# EAGLE design amp_test_arm_qfp (EAGLE 7.6.0)
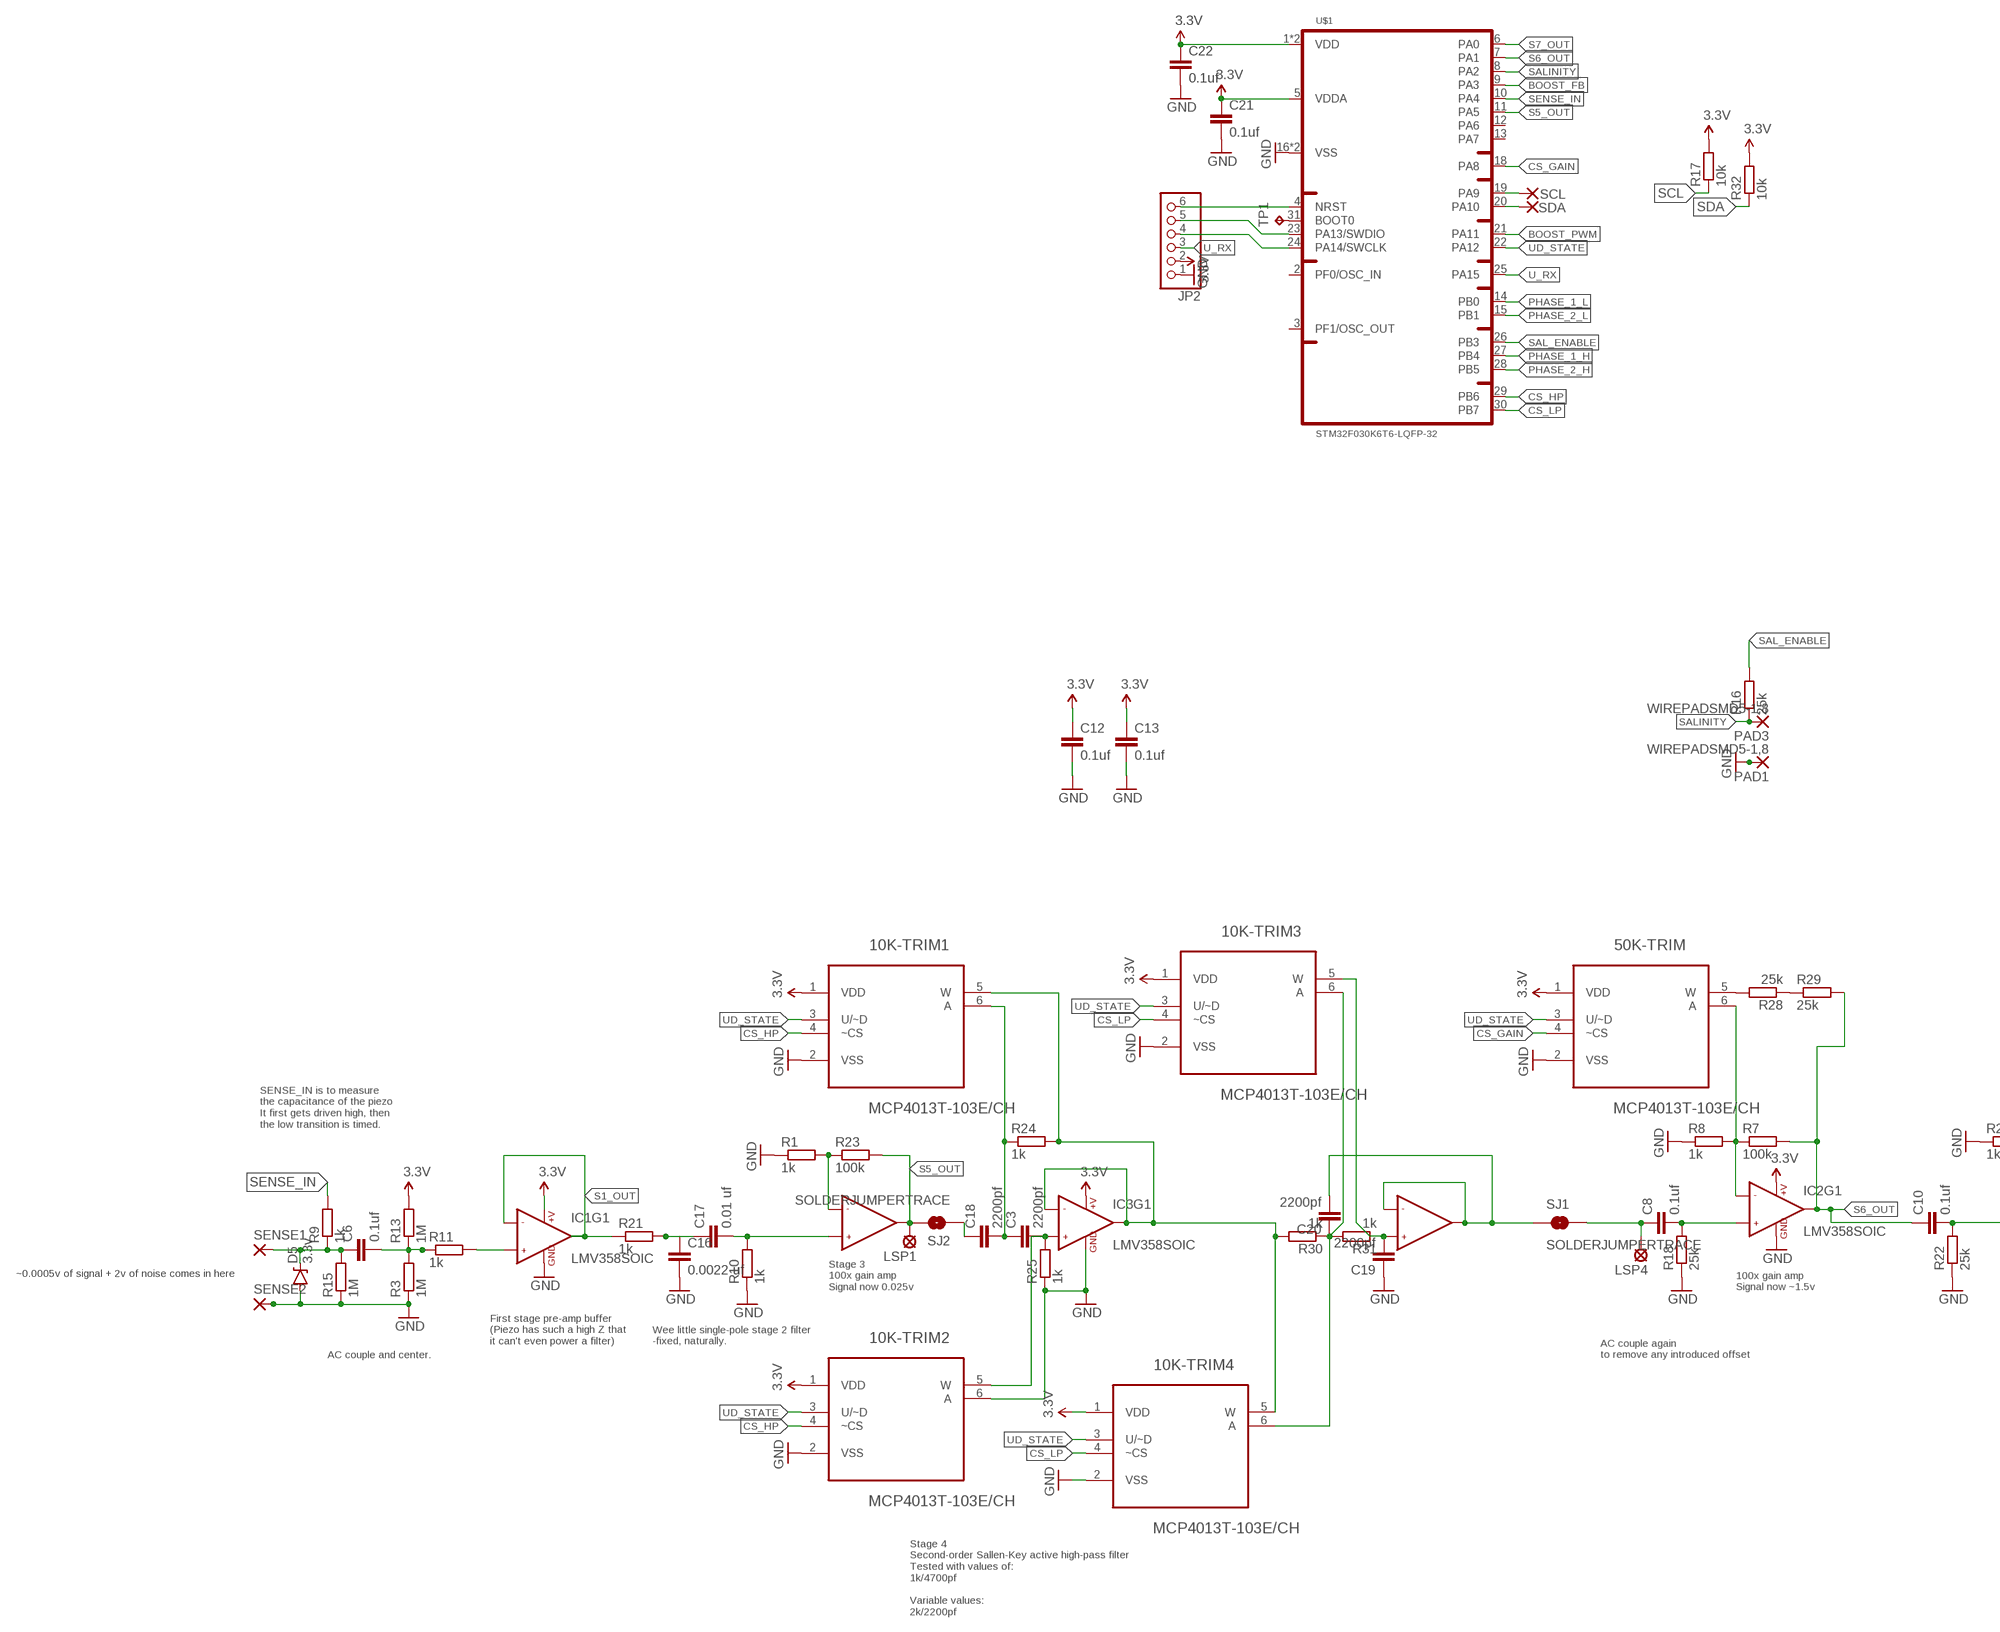
[diagram p0: schematic, sheet 1, part 1 of 2]
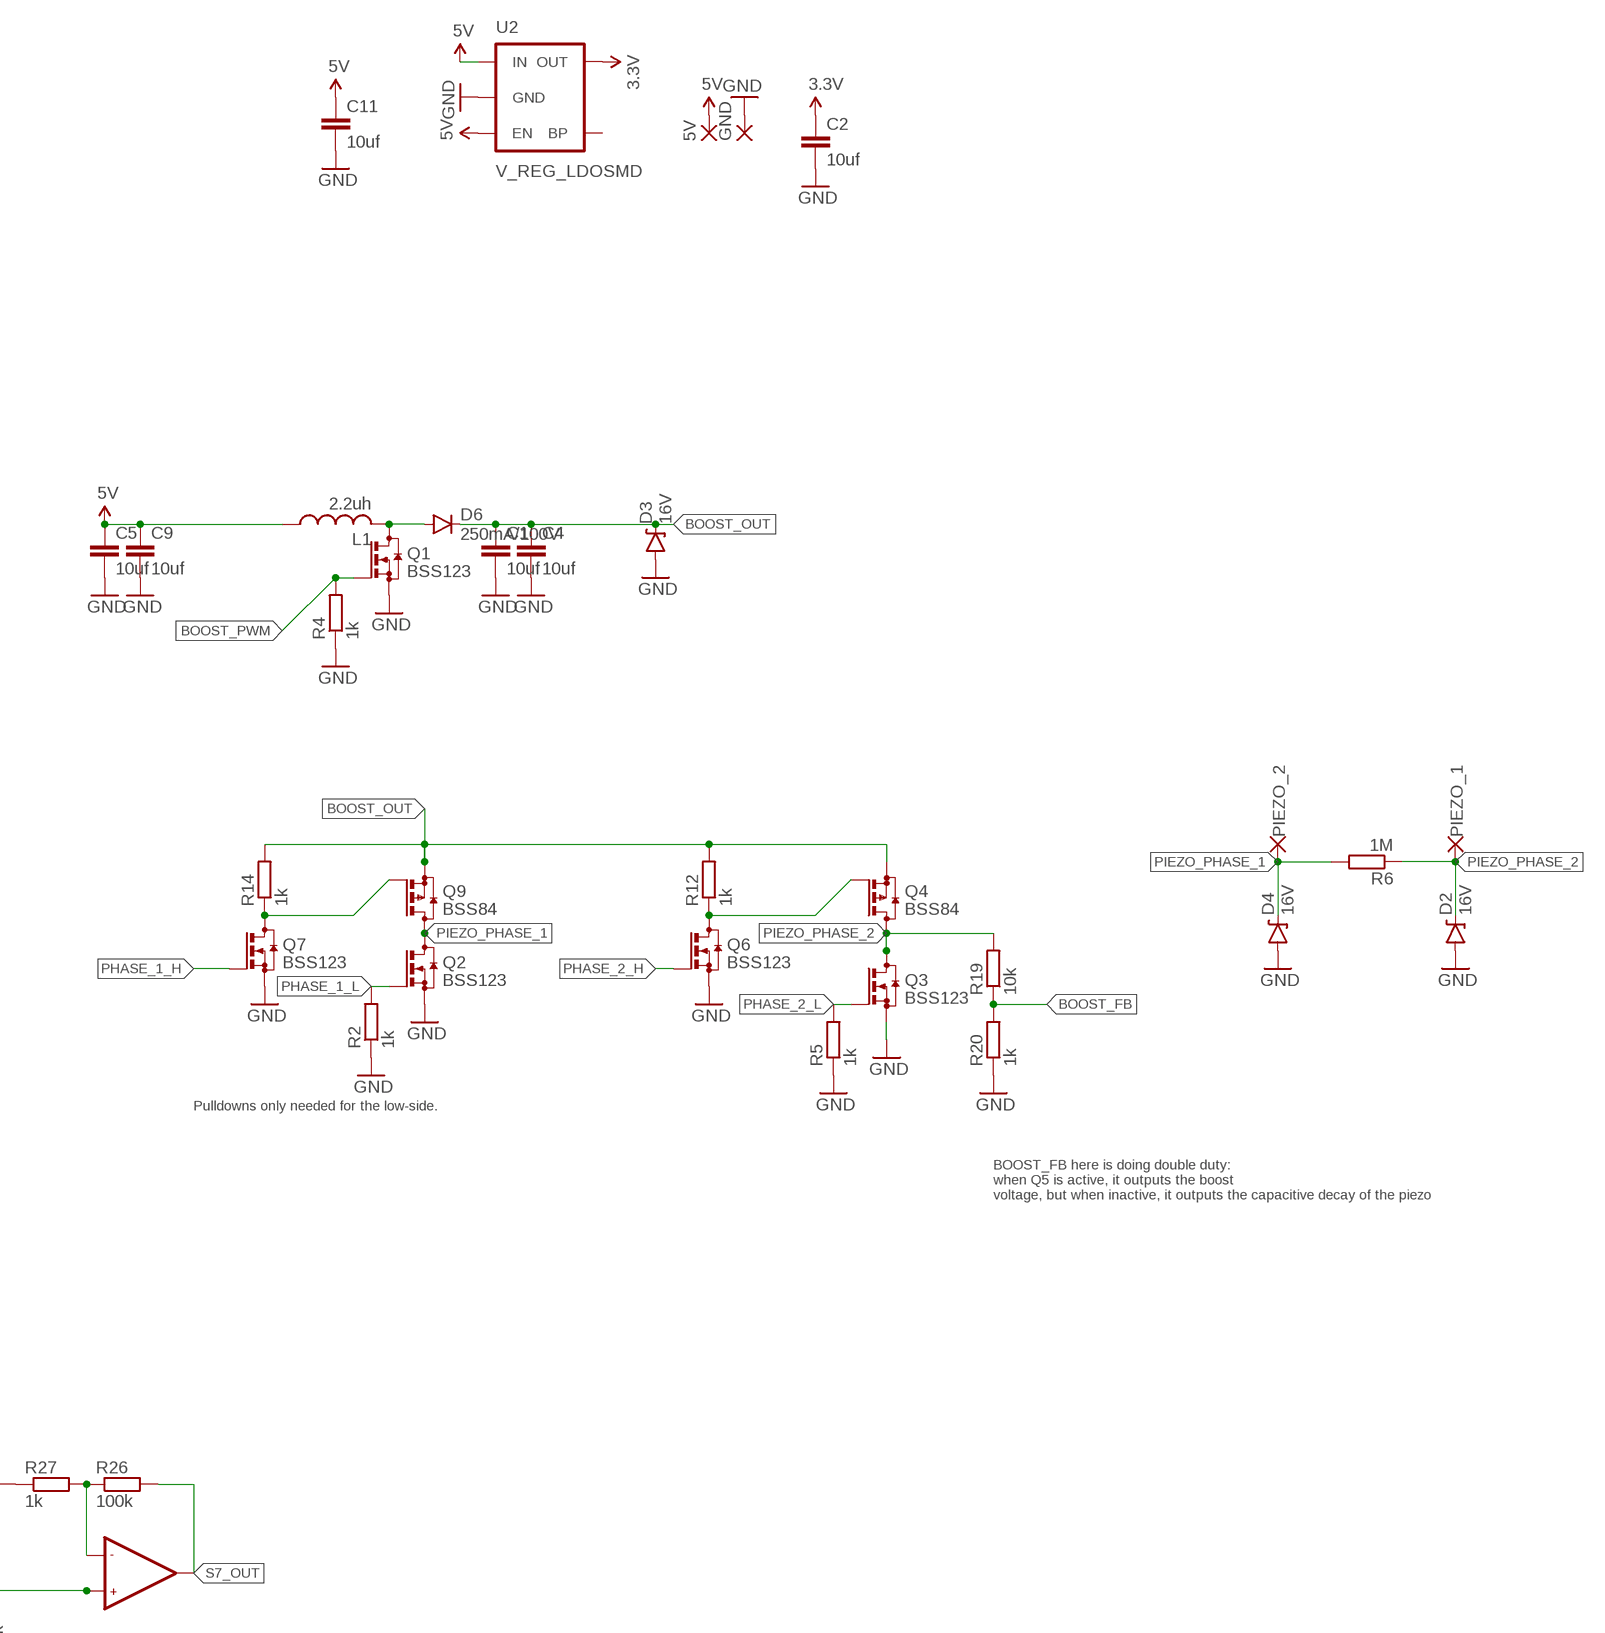
[diagram p1: schematic, sheet 1, part 2 of 2]

## Parts
5V  SMD5  [SMD2,54-5,08]
10K-TRIM1  MCP4013T-103E/CH  [SOT95P280X145-6N]
10K-TRIM2  MCP4013T-103E/CH  [SOT95P280X145-6N]
10K-TRIM3  MCP4013T-103E/CH  [SOT95P280X145-6N]
10K-TRIM4  MCP4013T-103E/CH  [SOT95P280X145-6N]
50K-TRIM  MCP4013T-103E/CH  [SOT95P280X145-6N]
C1  10uf  C-EUC0805  [C0805]
C2  10uf  C-EUC0603  [C0603]
C3  2200pf  C-EUC0603  [C0603]
C4  10uf  C-EUC0805  [C0805]
C5  10uf  C-EUC0603  [C0603]
C6  0.1uf  C-EUC0603  [C0603]
C8  0.1uf  C-EUC0603  [C0603]
C9  10uf  C-EUC0603  [C0603]
C10  0.1uf  C-EUC0603  [C0603]
C11  10uf  C-EUC0603  [C0603]
C12  0.1uf  C-EUC0603  [C0603]
C13  0.1uf  C-EUC0603  [C0603]
C16  0.0022 uf  C-EUC0603  [C0603]
C17  0.01 uf  C-EUC0603  [C0603]
C18  2200pf  C-EUC0603  [C0603]
C19  2200pf  C-EUC0603  [C0603]
C20  2200pf  C-EUC0603  [C0603]
C21  0.1uf  C-EUC0603  [C0603]
C22  0.1uf  C-EUC0603  [C0603]
D2  16V  DIODE-ZENER3.3V  [SOD-323]
D3  16V  DIODE-ZENER3.3V  [SOD-323]
D4  16V  DIODE-ZENER3.3V  [SOD-323]
D5  3.3v  DIODE-ZENER3.3V  [SOD-323]
D6  250mA/100V  DIODEBAS16  [SOD-323]
GND  SMD5  [SMD2,54-5,08]
IC1  LMV358SOIC  [SO08]
IC2  LMV358SOIC  [SO08]
IC3  LMV358SOIC  [SO08]
JP2  PINHD-1X6  [1X06]
L1  2.2uh  L-USL2825P  [L2825P]
LSP1  LSP10  [LSP10]
LSP4  LSP10  [LSP10]
PAD1  WIREPADSMD5-1,8  [5-1,8]
PAD3  WIREPADSMD5-1,8  [5-1,8]
PIEZO_1  SMD5  [SMD2,54-5,08]
PIEZO_2  SMD5  [SMD2,54-5,08]
Q1  BSS123  [SOT23]
Q2  BSS123  [SOT23]
Q3  BSS123  [SOT23]
Q4  BSS84  [SOT23]
Q6  BSS123  [SOT23]
Q7  BSS123  [SOT23]
Q9  BSS84  [SOT23]
R1  1k  R-EU_R0603  [R0603]
R2  1k  R-EU_R0603  [R0603]
R3  1M  R-EU_R0603  [R0603]
R4  1k  R-EU_R0603  [R0603]
R5  1k  R-EU_R0603  [R0603]
R6  1M  R-EU_R0603  [R0603]
R7  100k  R-EU_R0603  [R0603]
R8  1k  R-EU_R0603  [R0603]
R9  1k  R-EU_R0603  [R0603]
R10  1k  R-EU_R0603  [R0603]
R11  1k  R-EU_R0603  [R0603]
R12  1k  R-EU_R0603  [R0603]
R13  1M  R-EU_R0603  [R0603]
R14  1k  R-EU_R0603  [R0603]
R15  1M  R-EU_R0603  [R0603]
R16  25k  R-EU_R0603  [R0603]
R17  10k  R-EU_R0603  [R0603]
R18  25k  R-EU_R0603  [R0603]
R19  10k  R-EU_R0603  [R0603]
R20  1k  R-EU_R0603  [R0603]
R21  1k  R-EU_R0603  [R0603]
R22  25k  R-EU_R0603  [R0603]
R23  100k  R-EU_R0603  [R0603]
R24  1k  R-EU_R0603  [R0603]
R25  1k  R-EU_R0603  [R0603]
R26  100k  R-EU_R0603  [R0603]
R27  1k  R-EU_R0603  [R0603]
R28  25k  R-EU_R0603  [R0603]
R29  25k  R-EU_R0603  [R0603]
R30  1k  R-EU_R0603  [R0603]
R31  1k  R-EU_R0603  [R0603]
R32  10k  R-EU_R0603  [R0603]
SCL  SMD5  [SMD2,54-5,08]
SDA  SMD5  [SMD2,54-5,08]
SENSE1  SMD5  [SMD2,54-5,08]
SENSE2  SMD5  [SMD2,54-5,08]
SJ1  SOLDERJUMPERTRACE  [SJ_2S-TRACE]
SJ2  SOLDERJUMPERTRACE  [SJ_2S-TRACE]
TP1  TPTP12R  [TP12R]
U2  V_REG_LDOSMD  [SOT23-5]
U$1  STM32F030K6T6-LQFP-32  [LQFP-32]

## Nets
3.3V: 10K-TRIM1.1(VDD) 10K-TRIM2.1(VDD) 10K-TRIM3.1(VDD) 10K-TRIM4.1(VDD) 50K-TRIM.1(VDD) C2.1 C12.1 C13.1 C21.1 C22.1 IC1.8(+V) IC2.8(+V) IC3.8(+V) JP2.2 R13.2 R17.2 R32.2 U2.5(OUT) U$1.1(VDD) U$1.5(VDDA) U$1.17(VDD)
5V: 5V.1(P) C5.1 C9.1 C11.1 L1.1 U2.1(IN) U2.3(EN)
BOOST_FB: R19.1 R20.2 U$1.9(PA3)
BOOST_OUT: C1.1 C4.1 D3.C D6.C Q4.2(S) Q9.2(S) R12.2 R14.2
BOOST_PWM: Q1.1(G) R4.2 U$1.21(PA11)
CS_GAIN: 50K-TRIM.4(~CS) U$1.18(PA8)
CS_HP: 10K-TRIM1.4(~CS) 10K-TRIM2.4(~CS) U$1.29(PB6)
CS_LP: 10K-TRIM3.4(~CS) 10K-TRIM4.4(~CS) U$1.30(PB7)
GND: 10K-TRIM1.2(VSS) 10K-TRIM2.2(VSS) 10K-TRIM2.6(A) 10K-TRIM3.2(VSS) 10K-TRIM4.2(VSS) 50K-TRIM.2(VSS) C1.2 C2.2 C4.2 C5.2 C9.2 C11.2 C12.2 C13.2 C16.2 C19.1 C21.2 C22.2 D2.A D3.A D4.A D5.A GND.1(P) IC1.4(GND) IC2.4(GND) IC3.4(GND) JP2.1 PAD1.1(P) Q1.2(S) Q2.2(S) Q3.2(S) Q6.2(S) Q7.2(S) R1.1 R2.1 R3.1 R4.1 R5.1 R8.1 R10.1 R15.1 R18.1 R20.1 R22.1 R25.1 R27.1 SENSE2.1(P) U2.2(GND) U$1.16(VSS) U$1.32(VSS)
N$1: C10.2 IC2.5(+IN2) R22.2
N$2: Q4.1(G) Q6.3(D) R12.1
N$3: C20.2 IC3.6(-IN2) IC3.7(OUT2) SJ1.1
N$4: Q7.3(D) Q9.1(G) R14.1
N$5: TP1.TP U$1.31(BOOT0)
N$6: D6.A L1.2 Q1.3(D)
N$7: C6.2 R3.2 R11.1 R13.1
N$8: IC1.3(+IN1) R11.2
N$9: C16.1 C17.1 R21.2
N$10: C8.1 LSP4.MP SJ1.2
N$11: IC1.6(-IN2) R1.2 R23.1
N$12: C18.1 SJ2.1
N$13: C17.2 IC1.5(+IN2) R10.2
N$15: 50K-TRIM.6(A) IC2.2(-IN1) R7.1 R8.2
N$18: C8.2 IC2.3(+IN1) R18.2
N$19: 10K-TRIM3.5(W) C19.2 IC3.5(+IN2) R31.1
N$21: 10K-TRIM2.5(W) C3.2 IC3.3(+IN1) R25.2
N$22: 10K-TRIM1.5(W) 10K-TRIM4.5(W) IC3.1(OUT1) IC3.2(-IN1) R24.2 R30.2
N$23: 10K-TRIM1.6(A) C3.1 C18.2 R24.1
N$25: IC2.6(-IN2) R26.1 R27.2
N$26: 50K-TRIM.5(W) R28.2
N$27: R28.1 R29.1
N$28: 10K-TRIM3.6(A) 10K-TRIM4.6(A) C20.1 R30.1 R31.2
N$29: JP2.6 U$1.4(NRST)
N$30: JP2.5 U$1.23(PA13/SWDIO)
N$31: JP2.4 U$1.24(PA14/SWCLK)
PHASE_1_H: Q7.1(G) U$1.27(PB4)
PHASE_1_L: Q2.1(G) R2.2 U$1.14(PB0)
PHASE_2_H: Q6.1(G) U$1.28(PB5)
PHASE_2_L: Q3.1(G) R5.2 U$1.15(PB1)
PIEZO_IN: C6.1 D5.C R9.1 R15.2 SENSE1.1(P)
PIEZO_PHASE_1: D4.C PIEZO_2.1(P) Q2.3(D) Q9.3(D) R6.2
PIEZO_PHASE_2: D2.C PIEZO_1.1(P) Q3.3(D) Q4.3(D) R6.1 R19.2
S1_OUT: IC1.1(OUT1) IC1.2(-IN1) R21.1
S5_OUT: IC1.7(OUT2) LSP1.MP R23.2 SJ2.2 U$1.11(PA5)
S6_OUT: C10.1 IC2.1(OUT1) R7.2 R29.2 U$1.7(PA1)
S7_OUT: IC2.7(OUT2) R26.2 U$1.6(PA0)
SAL_ENABLE: R16.2 U$1.26(PB3)
SALINITY: PAD3.1(P) R16.1 U$1.8(PA2)
SCL: R17.1 SCL.1(P) U$1.19(PA9)
SDA: R32.1 SDA.1(P) U$1.20(PA10)
SENSE_IN: R9.2 U$1.10(PA4)
U_RX: JP2.3 U$1.25(PA15)
UD_STATE: 10K-TRIM1.3(U/~D) 10K-TRIM2.3(U/~D) 10K-TRIM3.3(U/~D) 10K-TRIM4.3(U/~D) 50K-TRIM.3(U/~D) U$1.22(PA12)
Unconnected: U2.4(BP) U$1.2(PF0/OSC_IN) U$1.3(PF1/OSC_OUT) U$1.12(PA6) U$1.13(PA7)

## Notes on the sheet
- Pulldowns only needed for the low-side.
- BOOST_FB here is doing double duty:
  when Q5 is active, it outputs the boost
  voltage, but when inactive, it outputs the capacitive decay of the piezo
- SENSE_IN is to measure
  the capacitance of the piezo
  It first gets driven high, then 
  the low transition is timed.
- ~0.0005v of signal + 2v of noise comes in here
- Stage 3
  100x gain amp
  Signal now 0.025v
- 100x gain amp
  Signal now ~1.5v
- First stage pre-amp buffer
  (Piezo has such a high Z that 
  it can't even power a filter)
- Wee little single-pole stage 2 filter
  -fixed, naturally.
- AC couple and center.
- AC couple again
  to remove any introduced offset
- Stage 4
  Second-order Sallen-Key active high-pass filter
  Tested with values of:
  1k/4700pf
  
  Variable values: 
  2k/2200pf

## Library data of the parts
5V GND PIEZO_1 PIEZO_2 SCL SDA SENSE1 SENSE2 = wirepad:SMD5: SMD PAD
10K-TRIM1-10K-TRIM4 50K-TRIM = MCP4013T-103E_CH:MCP4013T-103E/CH: Digital POT; DESCRIPTION: Digital Potentiometers with SPI Interface 10k, U/D single, 6-bit V, POT to GND; DIGI-KEY_PART_NUMBER: MCP4013T-103E/CHCT-ND; DIGI-KEY_PURCHASE_URL: https://www.digikey.ca/product-detail/en/microchip-technology/MCP4013T-103E-CH/MCP4013T-103E-CHCT-ND/1015697?WT.z_cid=ref_snapeda&utm_source=snapeda&utm_medium=aggregator&utm_campaign=buynow; MF: Microchip; MP: MCP4013T-103E/CH; PACKAGE: SOT-23-6 Microchip
C1-C6 C8-C13 C16-C22 = rcl:C-EU: CAPACITOR, European symbol
D2-D5 = SparkFun-DiscreteSemi:DIODE-ZENER: Zener Diode Production Part - 8199 3.4V Zener Voltage; PROD_ID: DIO-11284; VALUE: 3.3V
D6 = SparkFun-DiscreteSemi:DIODE: Diode These are standard reverse protection diodes and small signal diodes. SMA package can handle up to about 1A. SOD-323 can handle about 200mA. What the SOD-323 package when ordering, there are some mfgs out there that are 5-pin packages.; PROD_ID: DIO-09646
IC1-IC3 = SparkFun-AnalogIC:LMV358: Jellybean rail-to-rail output op-amp; PROD_ID: IC-09657
JP2 = pinhead:PINHD-1X6: PIN HEADER
L1 = rcl:L-US: INDUCTOR, American symbol
LSP1 LSP4 = solpad:LSP10: SOLDER PAD drill 1.0 mm, distributor Buerklin, 12H555
PAD1 PAD3 = wirepad:WIREPAD: Wire PAD connect wire on PCB
Q1-Q3 Q6 Q7 = transistor-small-signal:BSS123: N-CHANNEL MOS FET
Q4 Q9 = transistor-small-signal:BSS84: P-CHANNEL MOS FET
R1-R32 = rcl:R-EU_: RESISTOR, European symbol
SJ1 SJ2 = SparkFun-Retired:SOLDERJUMPER: Solder Jumper Standard SMD solder jumper. Used to automate production. Two varients : Normally Open and Normally Closed are the same, but have different paste layers. NC will have a large amount of paste and should jumper during reflow.
TP1 = testpad:TP: Test pad
U2 = SparkFun-PowerIC:V_REG_LDO: Voltage Regulator LDO Standard 150mA LDO voltage regulator in SOT-23 layout. Micrel part MIC5205. BP (by-pass) pin is used to lower output noise with 470pF cap.
U$1 = STM32F030K6T6:STM32F030K6T6

## Net classes
0 default: width 0.254 mm, drill 0.508 mm

## Board
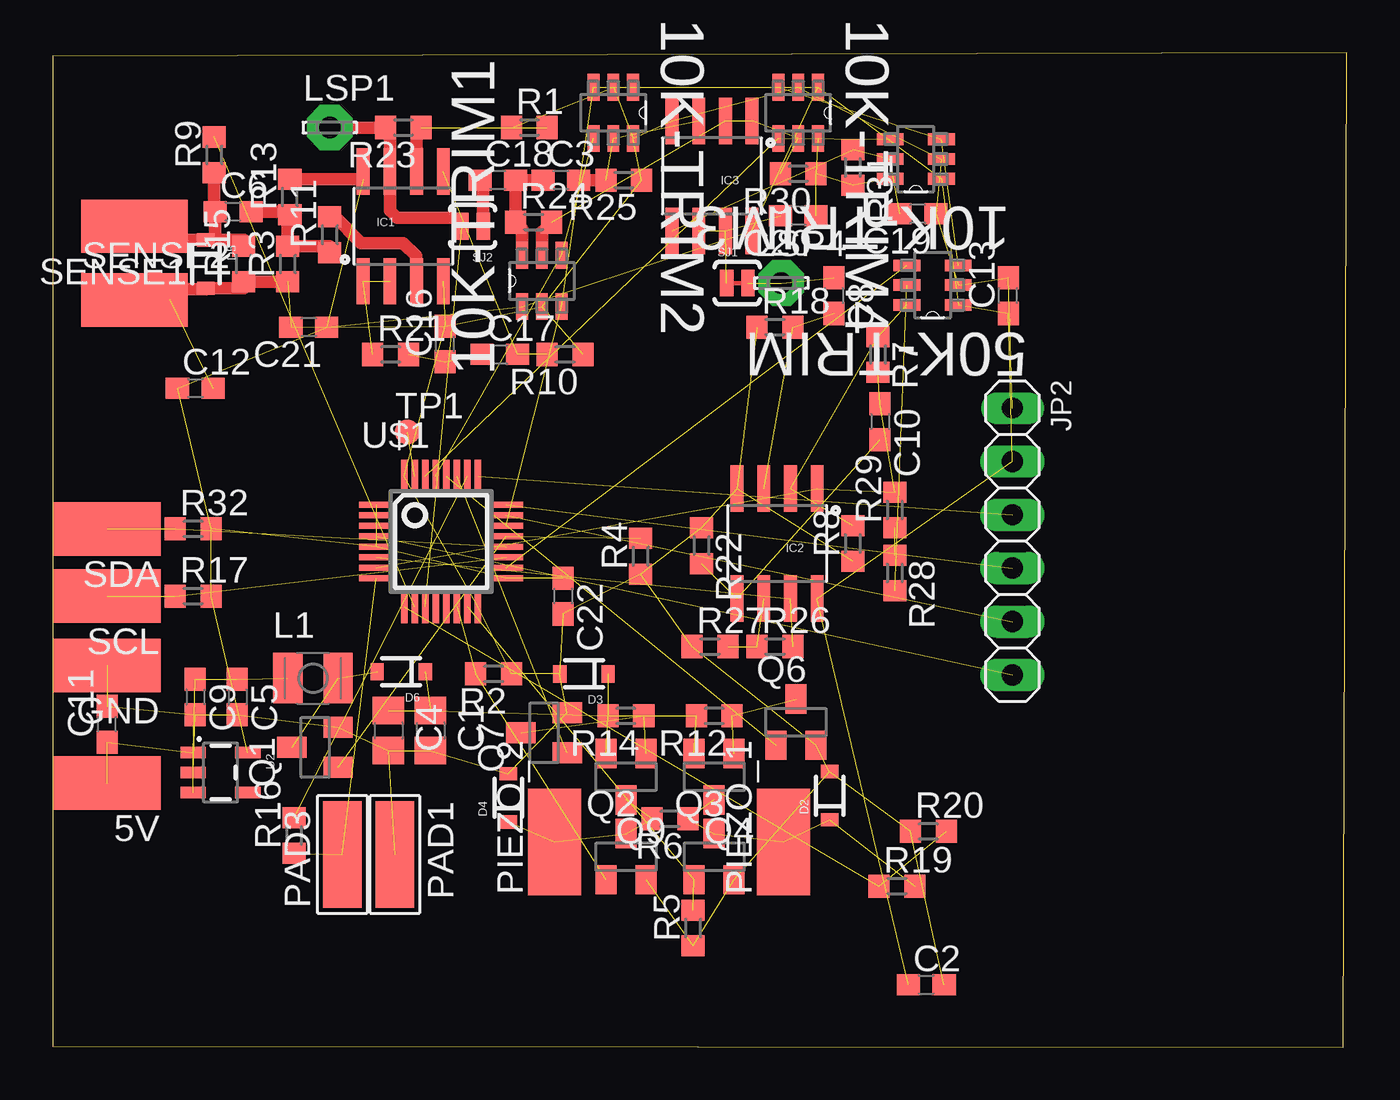
[diagram p2: board, top side]

Size 61.63 x 47.33 mm. Coordinates in mm from the lower left corner, seen from the top.
Outline: 0,0.03 61.45,0 61.63,47.33 0,47.16 0,0.03
Copper layers (1*16): Top 0.035mm / dielectric 1.5mm / Bottom 0.035mm
Design rules "default *": minimum track width 10mil, minimum drill 17mil, track to track 7mil, track to pad 7mil, pad to pad 7mil, via to via 7mil, smd to smd 7mil, copper to edge 40mil, drill to drill 8mil, minimum pad ring 10mil, minimum via ring 8mil, stop-mask expansion 4mil, vias tented up to drill 0mil, thermal gap 10mil

### Footprints (pad centres in the part's own frame; a part is rotated, then mirrored left to right if it is on the bottom)
SMD2,54-5,08 = smd 2.54 x 5.08: 1 0,0
SOT95P280X145-6N = smd 1.27 x 0.559: 1 -1.219,0.94; 2 -1.219,0; 3 -1.219,-0.94; 4 1.219,-0.94; 5 1.219,0; 6 1.219,0.94
C0805 = smd 1.3 x 1.5: 1 -0.95,0; 2 0.95,0
C0603 = smd 1.1 x 1: 1 -0.85,0; 2 0.85,0
SOD-323 = smd 0.63 x 0.83: A 1.15,0; C -1.15,0
SO08 = smd 0.61 x 2.21: 1 -1.905,-2.616; 2 -0.635,-2.616; 3 0.635,-2.616; 4 1.905,-2.616; 5 1.905,2.616; 6 0.635,2.616; 7 -0.635,2.616; 8 -1.905,2.616
1X06 = drill 0.991 long: 1 -6.35,0 | drill 1.016 long: 2 -3.81,0; 3 -1.27,0; 4 1.27,0; 5 3.81,0; 6 6.35,0
L2825P = smd 1.4 x 2.4: 1 -1.2,0; 2 1.2,0
LSP10 = drill 1.016 pad 2.159 octagon: MP 0,0
5-1,8 = smd 1.829 x 5.08: 1 0,0
SOT23 = smd 1 x 1.4: 1 -0.95,-1.1; 2 0.95,-1.1; 3 0,1.1
R0603 = smd 1 x 1.1: 1 -0.85,0; 2 0.85,0
SJ_2S-TRACE = smd 0.635 x 1.27: 1 -0.508,0; 2 0.508,0
TP12R = smd 1.2 x 1.2: TP 0,0
SOT23-5 = smd 0.55 x 1.2: 1 -0.95,-1.3; 2 0,-1.3; 3 0.95,-1.3; 4 0.95,1.3; 5 -0.95,1.3
LQFP-32 = smd 0.3 x 1.6: 1 -1.75,-3.1; 2 -1.25,-3.1; 3 -0.75,-3.1; 4 -0.25,-3.1; 5 0.25,-3.1; 6 0.75,-3.1; 7 1.25,-3.1; 8 1.75,-3.1; 17 1.75,3.1; 18 1.25,3.1; 19 0.75,3.1; 20 0.25,3.1; 21 -0.25,3.1; 22 -0.75,3.1; 23 -1.25,3.1; 24 -1.75,3.1 | smd 1.6 x 0.3: 9 3.1,-1.75; 10 3.1,-1.25; 11 3.1,-0.75; 12 3.1,-0.25; 13 3.1,0.25; 14 3.1,0.75; 15 3.1,1.25; 16 3.1,1.75; 25 -3.1,1.75; 26 -3.1,1.25; 27 -3.1,0.75; 28 -3.1,0.25; 29 -3.1,-0.25; 30 -3.1,-0.75; 31 -3.1,-1.25; 32 -3.1,-1.75

### Placement (x,y rotation side)
5V  2.6,12.56 90 top
10K-TRIM1  23.3,36.46 90 top
10K-TRIM2  26.7,44.46 270 top
10K-TRIM3  41.1,42.26 180 top
10K-TRIM4  35.5,44.46 270 top
50K-TRIM  41.9,36.26 180 top
C1  18,15.06 270 top
C2  41.6,2.96 0 top
C3  24.2,41.26 0 top
C4  16,15.06 270 top
C5  8.8,16.66 270 top
C6  8.6,39.76 0 top
C8  37.2,35.76 270 top
C9  6.8,16.66 270 top
C10  39.4,29.76 270 top
C11  2.6,15.36 90 top
C12  6.8,31.36 0 top
C13  45.5,35.76 90 top
C16  18.7,33.46 90 top
C17  21.3,32.96 0 top
C18  21.2,41.26 0 top
C19  41.2,39.66 180 top
C20  35.5,39.56 180 top
C21  12.2,34.26 180 top
C22  24.3,21.46 270 top
D2  37,11.96 90 top
D3  25.3,17.76 180 top
D4  21.7,11.86 90 top
D5  7.3,37.26 270 top
D6  16.6,17.86 180 top
GND  2.6,18.16 90 top
IC1  16.7,39.06 0 top
IC2  34.5,23.96 180 top
IC3  31.4,41.46 180 top
JP2  45.7,24.06 270 top
L1  12.4,17.56 0 top
LSP1  13.2,43.76 0 top
LSP4  34.7,36.36 0 top
PAD1  16.3,9.16 180 top
PAD3  13.8,9.16 0 top
PIEZO_1  34.8,9.76 0 top
PIEZO_2  23.9,9.76 0 top
Q1  12.5,14.26 90 top
Q2  27.3,9.06 0 top
Q3  31.5,9.06 0 top
Q4  31.5,12.86 180 top
Q6  35.4,15.46 0 top
Q7  23.4,14.96 90 top
Q9  27.3,12.86 180 top
R1  22.7,43.76 0 top
R2  21,17.76 180 top
R3  11.2,37.26 90 top
R4  28,23.36 90 top
R5  30.5,5.66 90 top
R6  29.4,10.86 180 top
R7  39.3,32.96 270 top
R8  38.1,23.96 90 top
R9  7.7,42.46 90 top
R10  24.4,32.96 180 top
R11  13.2,38.66 90 top
R12  31.5,15.76 180 top
R13  11.3,40.46 90 top
R14  27.3,15.76 180 top
R15  9.1,37.26 90 top
R16  11.5,10.06 90 top
R17  6.7,21.46 0 top
R18  34.4,34.26 0 top
R19  40.2,7.66 0 top
R20  41.7,10.26 0 top
R21  16.1,32.96 0 top
R22  30.9,23.86 270 top
R23  16.7,43.76 180 top
R24  22.9,39.26 0 top
R25  27.2,41.26 180 top
R26  34.4,19.06 0 top
R27  31.3,19.06 0 top
R28  40.1,22.56 270 top
R29  40.1,25.56 90 top
R30  35.5,41.56 180 top
R31  38.1,41.86 270 top
R32  6.7,24.66 0 top
SCL  2.6,21.46 90 top
SDA  2.6,24.66 90 top
SENSE1  3.9,39.06 90 top
SENSE2  3.9,35.56 270 top
SJ1  32.6,36.36 0 top
SJ2  20,39.06 180 top
TP1  16.9,29.26 0 top
U2  8,13.06 270 top
U$1  18.5,24.06 270 top

### Tracks (layer width: path | path; a pad name or v marks a point on that pad's centre or on a via)
3.3V  (19 unrouted)
  Top 0.6: R13.2 14.79,41.31 IC1.8
5V  (6 unrouted)
BOOST_FB  (2 unrouted)
BOOST_OUT  (7 unrouted)
BOOST_PWM  (2 unrouted)
CS_GAIN  (1 unrouted)
CS_HP  (2 unrouted)
CS_LP  (2 unrouted)
GND  (46 unrouted)
  Top 0.6: SENSE2.1 5.6,35.56 5.6,36.06 7.3,36.06 D5.A 9.1,36.11 R15.1 R3.1
N$1  (2 unrouted)
N$2  (2 unrouted)
N$3  (3 unrouted)
N$4  (2 unrouted)
N$5  (1 unrouted)
N$6  (2 unrouted)
N$7
  Top 0.6: C6.2 11.3,39.76 R13.1 11.2,39.61 R3.2 13.2,38.11 R11.1
N$8
  Top 0.6: R11.2 13.45,39.51 14.7,38.26 16.7,38.26 17.3,37.66 17.3,36.48 IC1.3
N$9  (2 unrouted)
N$10  (2 unrouted)
N$11  (1 unrouted)
  Top 0.6: IC1.6 17.34,43.54 R23.1
N$12
  Top 0.6: SJ2.1 20.51,41.4 C18.1
N$13  (2 unrouted)
N$15  (3 unrouted)
N$18  (2 unrouted)
N$19  (3 unrouted)
N$21  (2 unrouted)
  Top 0.6: C3.2 R25.2
N$22  (4 unrouted)
  Top 0.6: 10K-TRIM1.5 23.3,38.81 R24.2
N$23
  Top 0.6: C3.1 C18.2 22.05,40.36 R24.1 22.36,38.95 10K-TRIM1.6
N$25  (2 unrouted)
N$26  (1 unrouted)
N$27  (1 unrouted)
N$28  (4 unrouted)
N$29  (1 unrouted)
N$30  (1 unrouted)
N$31  (1 unrouted)
PHASE_1_H  (1 unrouted)
PHASE_1_L  (2 unrouted)
PHASE_2_H  (1 unrouted)
PHASE_2_L  (2 unrouted)
PIEZO_IN
  Top 0.6: SENSE1.1 3.9,38.41 D5.C 7.75,38.41 | 7.75,38.41 C6.1 7.7,39.76 R9.1 | 7.75,38.41 9.1,38.41 R15.2
PIEZO_PHASE_1  (4 unrouted)
PIEZO_PHASE_2  (5 unrouted)
S1_OUT  (2 unrouted)
S5_OUT  (1 unrouted)
  Top 0.6: LSP1.MP R23.2 16.06,43.54 IC1.7 16.06,39.79 16.4,39.46 19.09,39.46 SJ2.2
S6_OUT  (4 unrouted)
S7_OUT  (2 unrouted)
SAL_ENABLE  (1 unrouted)
SALINITY  (2 unrouted)
SCL  (2 unrouted)
SDA  (2 unrouted)
SENSE_IN  (1 unrouted)
U_RX  (1 unrouted)
UD_STATE  (5 unrouted)